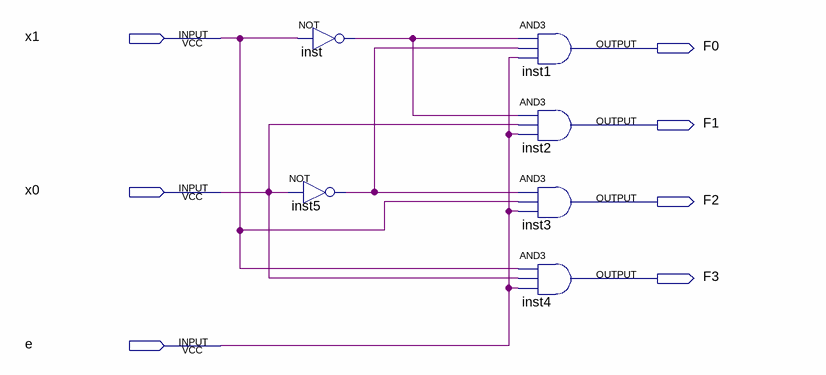
[diagram p0: schematic sheet]
// Quartus schematic dmx_gr.bdf as structural Verilog: 6 symbols, 7 pins
module dmx_gr (
  input  x1,
  input  x0,
  input  e,
  output F0,
  output F1,
  output F2,
  output F3
);

  wire inst5_out, inst_out;

  not inst (inst_out, x1);
  not inst5 (inst5_out, x0);
  and inst1 (F0, inst_out, inst5_out, e);
  and inst2 (F1, inst_out, x0, e);
  and inst3 (F2, inst5_out, x1, e);
  and inst4 (F3, x1, x0, e);
endmodule
